# EAGLE schematic Sch1 (EAGLE 9.6.1)
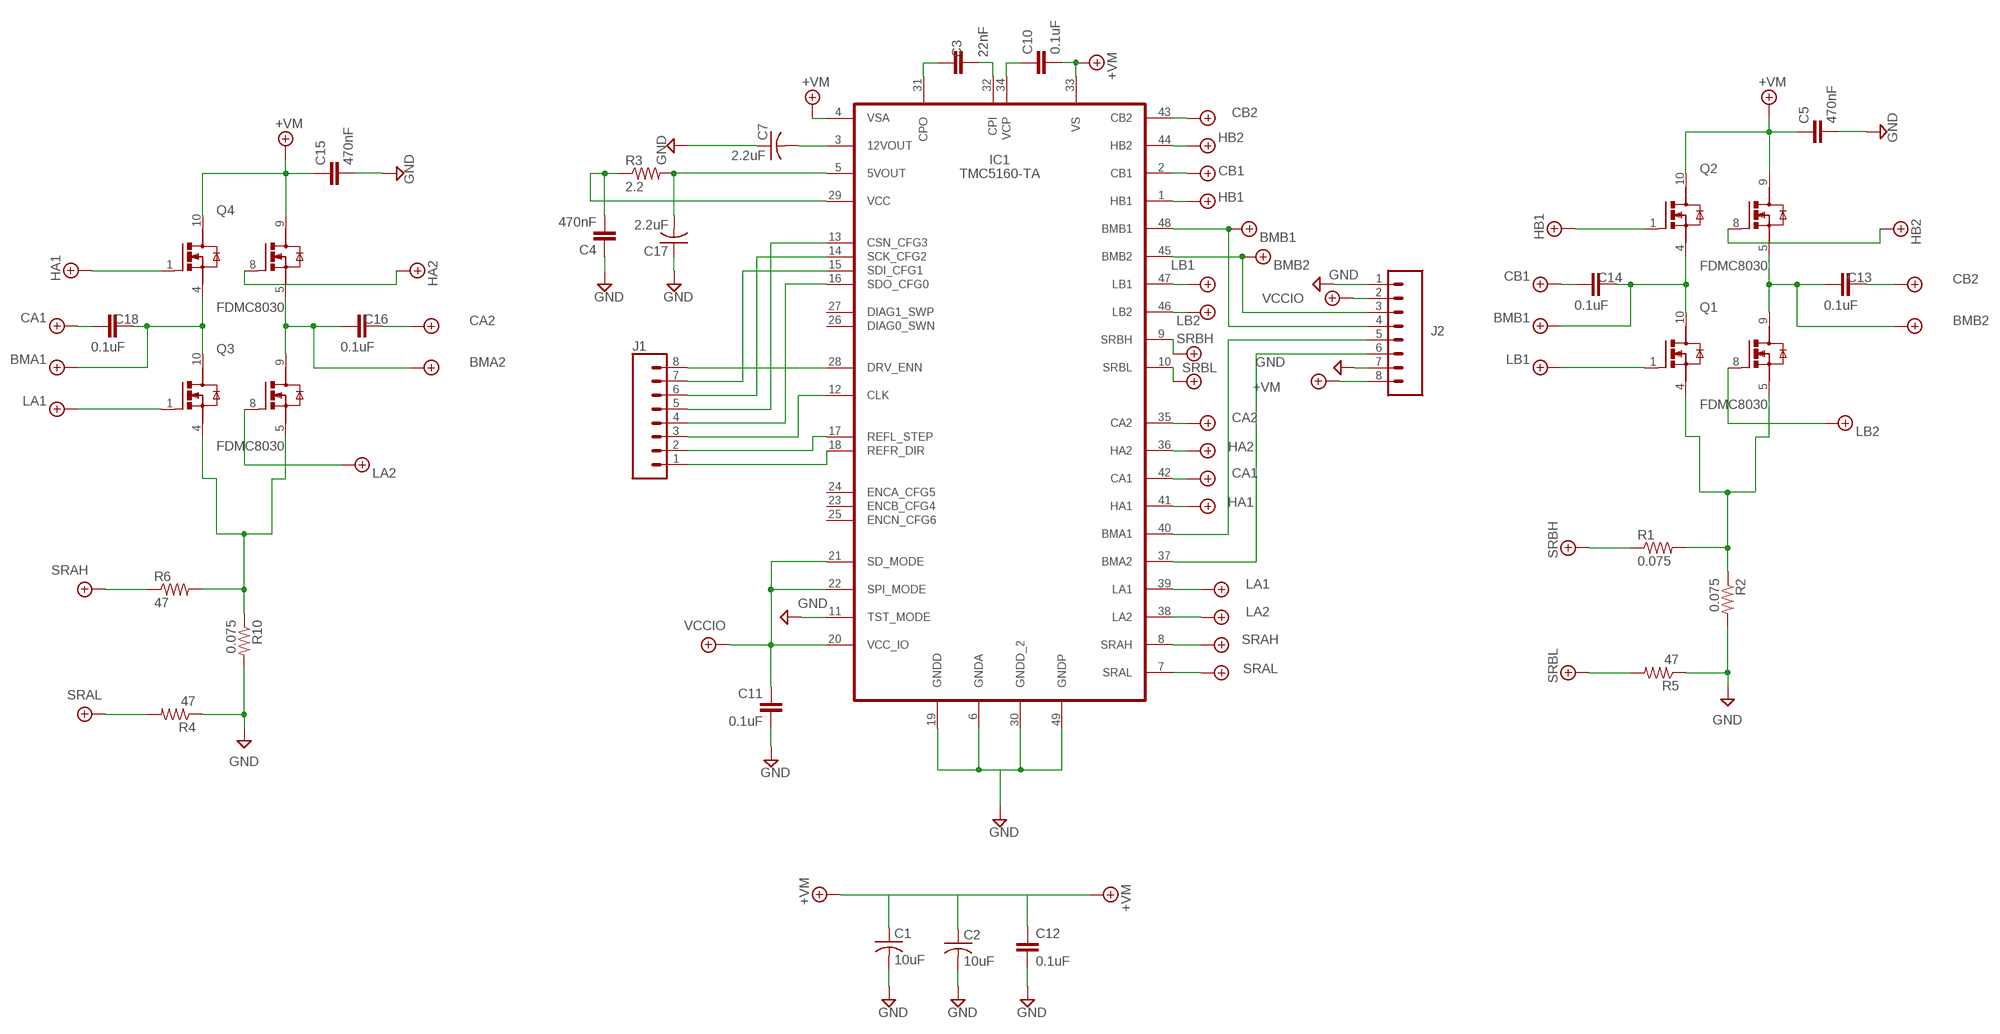
[diagram p0: schematic, sheet 1]

## Parts
C1  10uF  C-USC0805  [C0805]
C2  10uF  C-USC0805  [C0805]
C3  22nF  22NF/22,000PF-0603-50V-10%  [0603]
C4  470nF  470NF-0402-16V-10%  [0402]
C5  470nF  470NF-0402-16V-10%  [0402]
C7  2.2uF  C-USC0402  [C0402]
C10  0.1uF  0.1UF-0402-16V-10%  [0402]
C11  0.1uF  0.1UF-0402-16V-10%  [0402]
C12  0.1uF  0.1UF-0402-16V-10%  [0402]
C13  0.1uF  0.1UF-0402-16V-10%  [0402]
C14  0.1uF  0.1UF-0402-16V-10%  [0402]
C15  470nF  470NF-0402-16V-10%  [0402]
C16  0.1uF  0.1UF-0402-16V-10%  [0402]
C17  2.2uF  C-USC0402  [C0402]
C18  0.1uF  0.1UF-0402-16V-10%  [0402]
IC1  TMC5160-TA  [TQFP48-EP]
J1  CONN_08"  [1X08]
J2  CONN_08"  [1X08]
Q1  FDMC8030  [TRANS_FDMC8030]
Q2  FDMC8030  [TRANS_FDMC8030]
Q3  FDMC8030  [TRANS_FDMC8030]
Q4  FDMC8030  [TRANS_FDMC8030]
R1  0.075  R-US_R1206  [R1206]
R2  0.075  R-US_R1206  [R1206]
R3  2.2  R-US_R0402  [R0402]
R4  47  R-US_R0402  [R0402]
R5  47  R-US_R0402  [R0402]
R6  47  R-US_R0402  [R0402]
R10  0.075  R-US_R1206  [R1206]

## Nets
+5V: C11.1 IC1.20(VCC_IO) IC1.21(SD_MODE) IC1.22(SPI_MODE) J2.2 ; supply symbol labelled VCCIO
-4.1V: C1.1 C2.1 C5.1 C10.2 C12.1 C13.1 C13.2 C14.1 C14.2 C15.1 C16.1 C16.2 C18.1 C18.2 IC1.1(HB1) IC1.2(CB1) IC1.4(VSA) IC1.7(SRAL) IC1.8(SRAH) IC1.9(SRBH) IC1.10(SRBL) IC1.33(VS) IC1.35(CA2) IC1.36(HA2) IC1.38(LA2) IC1.39(LA1) IC1.41(HA1) IC1.42(CA1) IC1.43(CB2) IC1.44(HB2) IC1.45(BMB2) IC1.46(LB2) IC1.47(LB1) IC1.48(BMB1) J2.3 J2.4 J2.8 Q1.1(G1) Q1.8(G2) Q1.9(D2) Q1.10(D1) Q2.1(G1) Q2.4(S1) Q2.5(S2) Q2.8(G2) Q2.9(D2) Q2.10(D1) Q3.1(G1) Q3.8(G2) Q3.9(D2) Q3.10(D1) Q4.1(G1) Q4.4(S1) Q4.5(S2) Q4.8(G2) Q4.9(D2) Q4.10(D1) R1.1 R4.2 R5.2 R6.1 ; supply symbol labelled +VM, LB2, LB1, BMB1, CB1, BMB2, CB2, SRBH, SRBL, HB1, HB2, LA2, LA1, BMA1, CA1, BMA2, CA2, SRAH, SRAL, HA1, HA2
GND: C1.2 C2.2 C4.1 C5.2 C7.1 C11.2 C12.2 C15.2 C17.1 IC1.6(GNDA) IC1.11(TST_MODE) IC1.19(GNDD) IC1.30(GNDD_2) IC1.49(GNDP) J2.1 J2.7 R2.2 R4.1 R5.1 R10.2
N$1: C10.1 IC1.34(VCP)
N$2: IC1.18(REFR_DIR) J1.1
N$3: C3.1 IC1.31(CPO)
N$4: C3.2 IC1.32(CPI)
N$5: C7.2 IC1.3(12VOUT)
N$6: C17.2 IC1.5(5VOUT) R3.2
N$7: C4.2 IC1.29(VCC) R3.1
N$9: IC1.17(REFL_STEP) J1.2
N$10: IC1.12(CLK) J1.3
N$11: IC1.16(SDO_CFG0) J1.4
N$12: IC1.13(CSN_CFG3) J1.5
N$13: IC1.14(SCK_CFG2) J1.6
N$14: IC1.15(SDI_CFG1) J1.7
N$15: IC1.28(DRV_ENN) J1.8
N$17: IC1.40(BMA1) J2.5
N$18: IC1.37(BMA2) J2.6
N$19: Q3.4(S1) Q3.5(S2) R6.2 R10.1
N$20: Q1.4(S1) Q1.5(S2) R1.2 R2.1
Unconnected: IC1.23(ENCB_CFG4) IC1.24(ENCA_CFG5) IC1.25(ENCN_CFG6) IC1.26(DIAG0_SWN) IC1.27(DIAG1_SWP)

## Library data of the parts
C1 C2 C7 C17 = adafruit:C-US: CAPACITOR, American symbol
C3 = SparkFun-Capacitors:22NF/22,000PF: 0.022uF/22nF/22,000pF ceramic capacitors A capacitor is a passive two-terminal electrical component used to store electrical energy temporarily in an electric field.; PROD_ID: CAP-07885
C4 C5 C15 = SparkFun-Capacitors:470NF: 0.47uF/470nF ceramic capacitors A capacitor is a passive two-terminal electrical component used to store electrical energy temporarily in an electric field.; PROD_ID: CAP-09041
C10-C14 C16 C18 = SparkFun-Capacitors:0.1UF: 0.1µF ceramic capacitors A capacitor is a passive two-terminal electrical component used to store electrical energy temporarily in an electric field.; PROD_ID: CAP-12416
IC1 = TMC5160-TA:TMC5160-TA: Universal high voltage controller for two-phase bipolar stepper motor. TQFP48-EP; AVAILABILITY: Unavailable; DESCRIPTION: Bipolar Motor Driver BCD MOS External Power MOSFETs SPI, Step/Direction 48-TQFP-EP _7x7_; MF: Trinamic Motion; MP: TMC5160-TA; PACKAGE: TQFP-48 Trinamic Motion; PRICE: None
J1 J2 = SparkFun-Connectors:CONN_08: Multi connection point. Often used as Generic Header-pin footprint for 0.1 inch spaced/style header connections On any of the 0.1 inch spaced packages, you can populate with these: Break Away Headers - Straight <https://www.sparkfun.com/products/116> (PRT-00116) Break Away Male Headers - Right Angle <https://www.sparkfun.com/products/553> (PRT-00553) Female Headers <https://www.sparkfun.com/products/115> (PRT-00115) Break Away Headers - Machine Pin <https://www.sparkfun.com/products/117> (PRT-00117) Break Away Female Headers - Swiss Machine Pin <https://www.sparkfun.com/products/743> (PRT-00743) Arduino Stackable Header - 8 Pin <https://www.sparkfun.com/products/9279> (PRT-09279) For SCREWTERMINALS and SPRING TERMINALS visit here: Screw Terimnals on SparkFun.com <https://www.sparkfun.com/search/results?term=Screw+Terminals> (5mm/3.5mm/2.54mm spacing) This device is also useful as a general connection point to wire up your design to another part of your project. Our various solder wires solder well into these plated through hole pads. Hook-Up Wire - Assortment (Stranded, 22 AWG) <https://www.sparkfun.com/products/11375> (PRT-11375) Hook-Up Wire - Assortment (Solid Core, 22 AWG) <https://www.sparkfun.com/products/11367> (PRT-11367) View the entire wire category on our website here <https://www.sparkfun.com/categories/141> Special notes: Molex polarized connector foot print use with SKU : PRT-08231 with associated crimp pins and housings. 1MM SMD Version SKU: PRT-10208 NOTES ON THE VARIANTS LOCK and LOCK_LONGPADS... This footprint was designed to help hold the alignment of a through-hole component (i.e. 6-pin header) while soldering it into place. You may notice that each hole has been shifted either up or down by 0.005 of an inch from it's more standard position (which is a perfectly straight line). This slight alteration caused the pins (the squares in the middle) to touch the edges of the holes. Because they are alternating, it causes a "brace" to hold the component in place. 0.005 has proven to be the perfect amount of "off-center" position when using our standard breakaway headers. Although looks a little odd when you look at the bare footprint, once you have a header in there, the alteration is very hard to notice. Also,if you push a header all the way into place, it is covered up entirely on the bottom side.; PROD_ID: CONN-08438
Q1-Q4 = FDMC8030:FDMC8030: Dual N-Channel Power Trench® MOSFET 40 V, 12 A, 10 mΩ; AVAILABILITY: Unavailable; DESCRIPTION: Mosfet Array 2 N-Channel _Dual_ 40V 12A 800mW Surface Mount 8-Power33 _3x3_; MF: ON Semiconductor; MP: FDMC8030; PACKAGE: PowerWDFN-8 ON Semiconductor; PRICE: None
R1-R6 R10 = adafruit:R-US_: RESISTOR, American symbol